# Altium schematic sheet VCF.SchDoc: Voltage Controlled Filter
size Letter; SheetNumber: 8; SheetTotal: 10
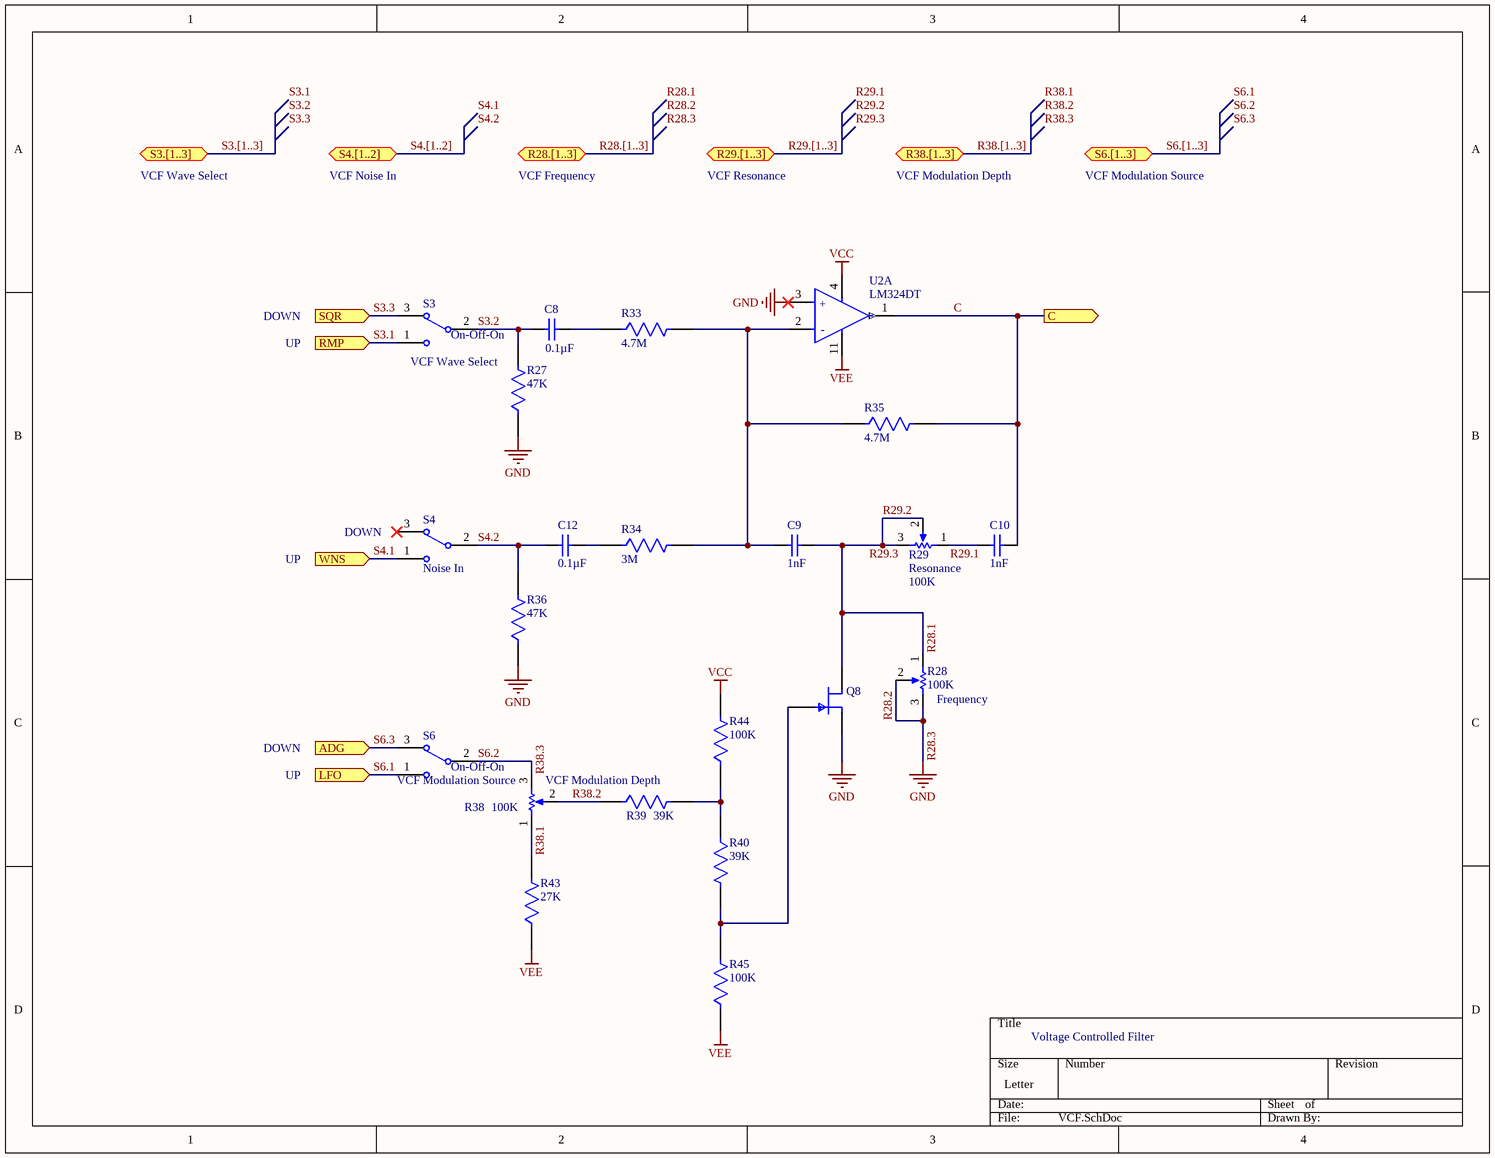
[diagram p0: VCF.SchDoc]

## Parts
C8  Capacitance: 0.1µF  [SAMS-C0603-2_M]  (hidden comment: CL10B104KB8NNNC)
C9  Capacitance: 1nF  [CAPC1608X90X35NL10T15]  (hidden comment: 885012206083‎)
C10  Capacitance: 1nF  [CAPC1608X90X35NL10T15]  (hidden comment: 885012206083‎)
C12  Capacitance: 0.1µF  [SAMS-C0603-2_M]  (hidden comment: CL10B104KB8NNNC)
Q8  MMBFJ113  [FP-318BM-IPC_C]  (value not drawn)
R27  Resistance: 47K  [FP-ESR03-IPC_B]  (hidden comment: ESR03EZPJ473)
R28  Frequency  value 100K  [VR5]  (graphical)
R29  Resonance  value 100K  [VR5]  (graphical)
R33  Resistance: 4.7M  [FP-ESR03-IPC_B]  (hidden comment: ESR03EZPJ475)
R34  Resistance: 3M  [FP-ESR03-IPC_B]  (hidden comment: ESR03EZPJ305)
R35  Resistance: 4.7M  [FP-ESR03-IPC_B]  (hidden comment: ESR03EZPJ475)
R36  Resistance: 47K  [FP-ESR03-IPC_B]  (hidden comment: ESR03EZPJ473)
R38  VCF Modulation Depth  value 100K  [VR5]  (graphical)
R39  Resistance: 39K  [FP-ESR03-IPC_B]  (hidden comment: ESR03EZPJ393)
R40  Resistance: 39K  [FP-ESR03-IPC_B]  (hidden comment: ESR03EZPJ393)
R43  Resistance: 27K  [FP-ESR03-IPC_B]  (hidden comment: ESR03EZPJ273)
R44  Resistance: 100K  [FP-ESR03-IPC_B]  (hidden comment: ESR03EZPJ104)
R45  Resistance: 100K  [FP-ESR03-IPC_B]  (hidden comment: ESR03EZPJ104)
S3  VCF Wave Select  Switch Function: On-Off-On  [HDR1X3]  (graphical)
S4  Noise In  [HDR1X3]
S6  VCF Modulation Source  Switch Function: On-Off-On  [HDR1X3]  (graphical)
U2  LM324DT  [FP-SO-14-MFG]  (part A of 4)

## Ports
ADG (in), C (out), LFO (in), R28.[1..3] (bidir), R29.[1..3] (bidir), R38.[1..3] (bidir), RMP (in), S3.[1..3] (bidir), S4.[1..2] (bidir), S6.[1..3] (bidir), SQR (in), WNS (in)

## Nets
R28.2: Q8.2(S) R27.1 R28.2(TAP) R28.3(BOT) R36.1 U2.3(Non-Inverting_Input_1)  [also labelled GND, R28.3]
VCC: R44.2 U2.4(VCC+)
VEE: R43.1 R45.1 U2.11(VCC-)
C: C10.2 R35.2 U2.1(Output_1) ; port C
R28.1: C9.2 Q8.1(D) R28.1(TOP) R29.2(TAP) R29.3(BOT)  [also labelled R29.2, R29.3]
R29.1: C10.1 R29.1(TOP)
R38.1: R38.1(TOP) R43.2
R38.2: R38.2(TAP) R39.1
R38.3: R38.3(BOT) S6.2  [also labelled S6.2]
S3.1: S3.1 ; port RMP
S3.2: C8.1 R27.2 S3.2
S3.3: S3.3 ; port SQR
S4.1: S4.1 ; port WNS
S4.2: C12.1 R36.2 S4.2
S6.1: S6.1 ; port LFO
S6.3: S6.3 ; port ADG
NetC8_2: C8.2 R33.1
NetC9_1: C9.1 R33.2 R34.2 R35.1 U2.2(Inverting_Input_1)
NetC12_2: C12.2 R34.1
NetQ8_3: Q8.3(G) R40.2 R45.2
NetR39_2: R39.2 R40.1 R44.1

Not connected (* = marked no-connect by the designer): S4 3*

## Buses and harness runs
bus R28.[1..3] = port R28.[1..3]
bus R29.[1..3] = port R29.[1..3]
bus R38.[1..3] = port R38.[1..3]
bus S3.[1..3] = port S3.[1..3]
bus S4.[1..2] = port S4.[1..2]
bus S6.[1..3] = port S6.[1..3]

## Notes on the sheet
- VCF Wave Select
- VCF Noise In
- VCF Frequency
- VCF Resonance
- VCF Modulation Depth
- VCF Modulation Source
- DOWN
- UP
- (near S4) DOWN
- Labels drawn without touching a wire or pin: R28.1, R28.2, R28.3, R29.1, R29.2, R29.3, R38.1, R38.2, R38.3, S3.1, S3.2, S3.3, S4.1, S4.2, S6.1, S6.2, S6.3
- (in symbol CMP-12131-000005-1, part A) +; -

## Library data of the parts
C8 C12 = CMP-2000-05332-1: Multi-layer Ceramic Capacitor, -55 to 125 degC, 2-Pin SMD (0603), RoHS, Tape and Reel; Manufacturer: Samsung Electro-Mechanics; Rated Voltage: 50V; Dielectric: X7R; Tolerance (%): ±10%; Case Size/Dimension: 0603; Datasheet URL: https://datasheet.ciiva.com/29198/456651-da-01-en-vs-kondensator-0605-29198839.pdf; Manufacturer URL: http://www.samsungsem.com/global/index.jsp; Datasheet Version: Nov-10
C9 C10 = CMP-2006-02891-1: Manufacturer: Wurth; Voltage Rating: 50V; Dielectric: X7R; Tolerance: 10%; Part Number: 885012206083‎; Supplier 1: RSComponents; Supplier Part Number 1: 8392938; Manufacturer Part Number: 885012206083; RoHS: Yes; Category: Ceramic Capacitors; Stock 1: 1; Pricing 1: 100=0.02300, 500=0.02000, 2000=0.01800, 4000=0.01600, 8000=0.00900 (USD); Mount: Surface Mount; Case/Package: 0603; Case Code (Metric): 1608; Case Code (Imperial): 0603; Min Operating Temperature: -55°C; Max Operating Temperature: 125°C; Packaging: Cut Tape; Voltage Rating (DC): 50V; Length: 0.063inch; Width: 0.031inch; Thickness: 0.037inch; REACH SVHC: Unknown; RoHS Compliant: Yes; ComponentLink1URL: http://www.farnell.com/datasheets/1958479.pdf?src-supplier=Farnell; ComponentLink1Description: http://www.farnell.com/datasheets/1958479.pdf?src-supplier=Farnell; ComponentLink2URL: http://www.farnell.com/datasheets/1958479.pdf?src-supplier=Element14; ComponentLink2Description: http://www.farnell.com/datasheets/1958479.pdf?src-supplier=Element14; ComponentLink3URL: https://katalog.we-online.de/pbs/datasheet/885012206083.pdf?src-supplier=Digi-Key; ComponentLink3Description: https://katalog.we-online.de/pbs/datasheet/885012206083.pdf?src-supplier=Digi-Key; ComponentLink4URL: http://www.farnell.com/datasheets/1958479.pdf?src-supplier=Newark; ComponentLink4Description: http://www.farnell.com/datasheets/1958479.pdf?src-supplier=Newark
Q8 = CMP-07172-000001-1: JFET N-CH 35V 350MW SOT23; Manufacturer: ON Semiconductor; Number Of N Channels: 1; Gate To Source Voltage: -35V; Drain To Source Resistance: 100Ω; Standoff Height: 0mm; Rthja Max: 357°C/W; Max Junction Temp: +150°C; Gate to Source Voltage (Vgs): -25V; Element Configuration: Single; Input Capacitance: 7pF; Drain to Source Voltage (Vdss): 25V; Continuous Drain Current (ID): 5mA; Current Rating: 10mA; Polarity: N-CHANNEL; Device Class L2: Transistors; Number Of Channels: 1; ComponentLink2Description: Datasheet; Device Class L3: JFETs; Device Class L1: Discrete Semiconductors; Lead Free: Yes; Power Dissipation: 350mW; Category: Trans; Mouser Description: JFET N-Channel Switch; ComponentLink2URL: https://www.onsemi.com/pub/Collateral/MMBFJ113-D.PDF; RoHS: TRUE; Footprint Url: https://www.onsemi.com/pub/Collateral/318BM.PDF; Height: 1.2mm; Package: 318BM; Temperature Range High: +150°C; Manufacturer Part Number: MMBFJ113; Temperature: -55°C to +150°C; Digikey Description: JFET N-CH 35V 350MW SOT23; Temperature Range Low: -55°C; Octopart: https://octopart.com/mmbfj113-on+semiconductor-84330253; Automotive: No; Ipc Land Pattern Name: SOT95P240X120-3; Supplier 1: Digi-Key; Supplier Part Number 1: MMBF5457CT-ND; Stock 1: 13304; Pricing 1: 1=0.50000, 10=0.39000, 25=0.37280, 100=0.23400, 500=0.21670, 1000=0.14736 (USD); Mount: Surface Mount; Case/Package: SOT-23; Number of Pins: 3; Weight: 0.03g; Contact Plating: Tin,Matte; Min Operating Temperature: -55°C; Max Operating Temperature: 150°C; Packaging: Tape and Reel; Package Quantity: 1; Max Power Dissipation: 350mW; Voltage Rating (DC): 25V; Series: MMBF5457; Length: 2.92mm; Width: 1.3mm; Radiation Hardening: No; RoHS Compliant: Yes; REACH SVHC: No SVHC; ComponentLink1URL: https://datasheet.ciiva.com/25625/0900766b810cdc04-25625787.pdf?src-supplier=RSComponents; ComponentLink1Description: https://datasheet.ciiva.com/25625/0900766b810cdc04-25625787.pdf?src-supplier=RSComponents; ComponentLink3URL: https://datasheet.ciiva.com/8120/mmbf5459-8120391.pdf?src-supplier=Avnet; ComponentLink3Description: https://datasheet.ciiva.com/8120/mmbf5459-8120391.pdf?src-supplier=Avnet; ComponentLink4URL: https://datasheet.ciiva.com/26026/mmbf5459-26026568.pdf?src-supplier=Avnet+Europe; ComponentLink4Description: https://datasheet.ciiva.com/26026/mmbf5459-26026568.pdf?src-supplier=Avnet+Europe; ComponentLink5URL: https://datasheet.ciiva.com/960/mmbf5457-960906.pdf?src-supplier=Digi-Key; ComponentLink5Description: https://datasheet.ciiva.com/960/mmbf5457-960906.pdf?src-supplier=Digi-Key; ComponentLink6URL: https://datasheet.ciiva.com/960/mmbf5457-960907.pdf?src-supplier=Digi-Key; ComponentLink6Description: https://datasheet.ciiva.com/960/mmbf5457-960907.pdf?src-supplier=Digi-Key; ComponentLink7URL: https://datasheet.ciiva.com/46445/46943-46445739.pdf?src-supplier=Element14; ComponentLink7Description: https://datasheet.ciiva.com/46445/46943-46445739.pdf?src-supplier=Element14; ComponentLink8URL: https://datasheet.ciiva.com/960/mmbf5457-960908.pdf?src-supplier=Digi-Key; ComponentLink8Description: https://datasheet.ciiva.com/960/mmbf5457-960908.pdf?src-supplier=Digi-Key; ComponentLink9URL: https://datasheet.ciiva.com/3304/mmbf5459-3304349.pdf?src-supplier=Avnet; ComponentLink9Description: https://datasheet.ciiva.com/3304/mmbf5459-3304349.pdf?src-supplier=Avnet
R27 R36 = CMP-08839-028279-1: 47kΩ ±5% 0.25W 0603 Anti-Surge Chip Resistor AEC-Q200; Max Power Dissipation: 250mW; Temperature Coefficient: 200ppm/°C; Series: ESR; Number of Terminations: 2; Min Operating Temperature: -55°C; Features: Automotive AEC-Q200; Width: 0.031inch; Case Code (Imperial): 0603; Case/Package: 0603; Packaging: Tape and Reel; Resistor Type: Thick Film; Length: 0.063inch; Tolerance: 5%; Package Quantity: 1; Max Operating Temperature: 155°C; Height: 0.022inch; Case Code (Metric): 1608; RoHS Compliant: Yes
R28 R29 R38 = RPot: Potentiometer; Sim Note: Enter the Resistance value and the set point into parameter fields.; Set Position: 0.5; Published: 8-Jun-2000; LatestRevisionDate: 17-Jul-2002; LatestRevisionNote: Re-released for DXP Platform.; PackageReference: VR5; Publisher: Altium Limited; PackageDescription: Variable Resistor, Thru-Hole; 3 Leads
R33 R35 = CMP-08839-028926-1: 4.7MΩ ±5% 0.25W 0603 Anti-Surge Chip Resistor AEC-Q200; Temperature Coefficient: 200ppm/°C; Max Power Dissipation: 250mW; Series: ESR; Package Quantity: 5000; Packaging: Cut Tape; Min Operating Temperature: -55°C; RoHS Compliant: Yes; Number of Terminations: 2; Resistor Type: Thick Film; Tolerance: 5%; Length: 0.063inch; Height: 0.022inch; Width: 0.031inch; Case Code (Metric): 1608; Case/Package: 0603; Max Operating Temperature: 155°C; Features: Automotive AEC-Q200; Case Code (Imperial): 0603
R34 = CMP-08839-028673-1: 3MΩ ±5% 0.25W 0603 Anti-Surge Chip Resistor AEC-Q200; Max Power Dissipation: 250mW; Temperature Coefficient: 200ppm/°C; Case Code (Metric): 1608; Resistor Type: Thick Film; Tolerance: 5%; Length: 0.063inch; Case Code (Imperial): 0603; Max Operating Temperature: 155°C; Packaging: Tape and Reel; Package Quantity: 5000; Case/Package: 0603; Series: ESR; Width: 0.031inch; Min Operating Temperature: -55°C; Height: 0.022inch; RoHS Compliant: Yes; Features: Automotive AEC-Q200; Number of Terminations: 2
R39 R40 = CMP-08839-004997-1: 39kΩ ±5% 0.25W 0603 Anti-Surge Chip Resistor AEC-Q200; Max Power Dissipation: 250mW; Temperature Coefficient: 200ppm/°C; Case Code (Imperial): 0603; Min Operating Temperature: -55°C; Features: Automotive AEC-Q200; Length: 0.063inch; Case/Package: 0603; Max Operating Temperature: 155°C; Resistor Type: Thick Film; Package Quantity: 5000; Case Code (Metric): 1608; Number of Terminations: 2; Packaging: Cut Tape; Tolerance: 5%; Width: 0.031inch; Series: ESR; RoHS Compliant: Yes; Height: 0.022inch
R43 = CMP-08839-028661-1: 27kΩ ±5% 0.25W 0603 Anti-Surge Chip Resistor AEC-Q200; Temperature Coefficient: 200ppm/°C; Max Power Dissipation: 250mW; Max Operating Temperature: 155°C; Case Code (Metric): 1608; Case Code (Imperial): 0603; Width: 0.031inch; Packaging: Cut Tape; Series: ESR; Number of Terminations: 2; RoHS Compliant: Yes; Case/Package: 0603; Features: Automotive AEC-Q200; Tolerance: 5%; Length: 0.063inch; Height: 0.022inch; Min Operating Temperature: -55°C; Resistor Type: Thick Film; Package Quantity: 5000
R44 R45 = CMP-08839-029521-1: 100kΩ ±5% 0.25W 0603 Anti-Surge Chip Resistor AEC-Q200; Power Rating: 200mW; Max Power Dissipation: 250mW; Temperature Coefficient: 200ppm/°C; Length: 0.063inch; Case Code (Imperial): 0603; Case/Package: 0603; Resistor Type: Thick Film; Features: Automotive AEC-Q200; Package Quantity: 1; Width: 0.031inch; Packaging: Cut Tape; Min Operating Temperature: -55°C; Series: ESR; RoHS Compliant: Yes; Size Code: 0603; Tolerance: 5%; Height: 0.022inch; Max Operating Temperature: 155°C; Lead Free: Lead Free; Case Code (Metric): 1608; Number of Terminations: 2
S3 S6 = SW-SPDT: Switch Toggle ON OFF ON SPDT Round Lever Solder Lug 5A 250VAC 28VDC Panel Mount with Threads; Manufacturer: E-Switch; Manufacturer Part Number: 100SP3T1B1M1QEH; Actuator Material: Brass,Chrome; Actuator Color: Chrome; Voltage Rating (AC): 120V; Voltage Rating (DC): 28V; Illumination Type: Non-Illuminated,Illuminated; Electrical Life: 40000Cycles; Actuator Type: Standard Round; Contact Resistance: 100mR; Max Voltage Rating (AC): 250V; Actuator Length: 10.41mm; Published: 24-Mar-1999; LatestRevisionDate: 17-Dec-2003; LatestRevisionNote: Schematic revised, PCB Footprint replaced.; DatasheetVersion: 05-Dec-2000; PackageReference: TL36WW15050; Publisher: Altium Limited; PackageDescription: Switch; 4 Leads; ComponentLink1Description: Manufacturer Link; ComponentLink1URL: http://www.apem.com; Supplier 1: Newark; Supplier Part Number 1: 16N0109; RoHS: Yes; Category: Toggle Switches; Stock 1: 100; Pricing 1: 1=3.40000, 10=3.05000, 25=2.88000, 50=2.75000, 100=2.61000, 250=2.50000 (USD); Mount: Panel; Contact Material: Copper Alloy,Silver; Contact Plating: Silver; Housing Material: Stainless Steel; Min Operating Temperature: -30°C; Max Operating Temperature: 85°C; Throw Configuration: SPDT; Package Quantity: 1; Packaging: Bulk; Termination: Solder; Orientation: Straight; Series: 100; Current Rating: 5A; Max Voltage Rating (DC): 28V; Lead Free: Lead Free; RoHS Compliant: Yes; ComponentLink2URL: https://datasheet.ciiva.com/2905/1012730000-jpg-2905501.pdf?src-supplier=Digi-Key; ComponentLink2Description: https://datasheet.ciiva.com/2905/1012730000-jpg-2905501.pdf?src-supplier=Digi-Key; ComponentLink3URL: https://datasheet.ciiva.com/24480/st113001-24480688.pdf?src-supplier=Onlinecomponents.com; ComponentLink3Description: https://datasheet.ciiva.com/24480/st113001-24480688.pdf?src-supplier=Onlinecomponents.com; ComponentLink4URL: https://datasheet.ciiva.com/16338/100-16338027.pdf?src-supplier=Future+Electronics; ComponentLink4Description: https://datasheet.ciiva.com/16338/100-16338027.pdf?src-supplier=Future+Electronics
S4 = SW-SPDT: Switch Toggle ON None ON SPDT Round Lever Solder Lug 5A 250VAC 28VDC Panel Mount with Threads; Manufacturer: E-Switch; Manufacturer Part Number: 100SP1T1B1M1QEH; Actuator Material: Brass,Chrome; Actuator Color: Chrome; Voltage Rating (AC): 120V; Voltage Rating (DC): 28V; Max Voltage Rating (AC): 250V; Illumination Type: Illuminated,Non-Illuminated; Switch Function: On-On; Actuator Type: Standard Round; Contact Resistance: 100mR; Electrical Life: 40000Cycles; Actuator Length: 10.41mm; Supplier 1: Newark; Supplier Part Number 1: 15N9971; RoHS: Yes; Category: Toggle Switches; Stock 1: 978; Pricing 1: 1=3.08000, 10=2.76000, 25=2.61000, 50=2.49000, 100=2.37000 (USD); Mount: Panel; Contact Material: Copper Alloy,Silver; Contact Plating: Silver; Housing Material: Stainless Steel; Min Operating Temperature: -30°C; Max Operating Temperature: 85°C; Throw Configuration: SPDT; Current Rating: 5A; Package Quantity: 1; Packaging: Bulk; Max Voltage Rating (DC): 28V; Termination: Solder; Orientation: Straight; Series: 100; REACH SVHC: No SVHC; Lead Free: Lead Free; RoHS Compliant: Yes; ComponentLink1URL: https://datasheet.ciiva.com/2904/st110007c-2904798.pdf?src-supplier=Digi-Key; ComponentLink1Description: https://datasheet.ciiva.com/2904/st110007c-2904798.pdf?src-supplier=Digi-Key; ComponentLink2URL: https://datasheet.ciiva.com/16154/xt0157p-16154561.pdf?src-supplier=Onlinecomponents.com; ComponentLink2Description: https://datasheet.ciiva.com/16154/xt0157p-16154561.pdf?src-supplier=Onlinecomponents.com; ComponentLink3URL: https://datasheet.ciiva.com/16347/100-16347391.pdf?src-supplier=Future+Electronics; ComponentLink3Description: https://datasheet.ciiva.com/16347/100-16347391.pdf?src-supplier=Future+Electronics
U2 = CMP-12131-000005-1: IC OPAMP GP 4 CIRCUIT 14SO; Manufacturer: STMicroelectronics; Voltage Gain: 100dB; Standoff Height: 0.1mm; Bandwidth: 1.3MHz; Max Junction Temp: +150°C; Min Supply Voltage: 3V; Max Dual Supply Voltage: 15V; Min Dual Supply Voltage: 1.5V; Number Of Channels: 4; Nominal Supply Current: 0.7-1.5mA; Output Current Per Channel: 20-50mA; Max Supply Voltage: 30V; Input Offset Voltage: 2mV; Input Bias Current: 0.02uA; Device Class L1: Integrated Circuits (ICs); Device Class L3: Amplifiers - Op Amps; Temperature Range Low: 0°C; Package: SO-14; Temperature Range High: +70°C; Digikey Description: IC OPAMP GP 4 CIRCUIT 14SO; Device Class L2: Linear ICs; Footprint Url: https://www.st.com/content/ccc/resource/technical/document/datasheet/group3/10/8a/e6/12/f8/e8/49/ce/DM00366438/files/DM00366438.pdf/jcr:content/translations/en.DM00366438.pdf; Octopart: https://octopart.com/lm324dt-stmicroelectronics-39579146; ComponentLink2URL: https://www.st.com/content/ccc/resource/technical/document/datasheet/bd/fc/46/43/26/8f/40/7f/CD00001046.pdf/files/CD00001046.pdf/jcr:content/translations/en.CD00001046.pdf; ComponentLink2Description: Datasheet; Lead Free: Yes; Temperature: 0°C to +70°C; RoHS: TRUE; Gain Bandwidth: 1.3MHz; Manufacturer Part Number: LM324DT; Automotive: No; Category: IC; Height: 1.75mm; Mouser Description: LM324 Series 32 V 1.3 MHz Low Power Quad Operational Amplifier - SOIC-14